# Altium schematic sheet In-Out.SchDoc
size A4
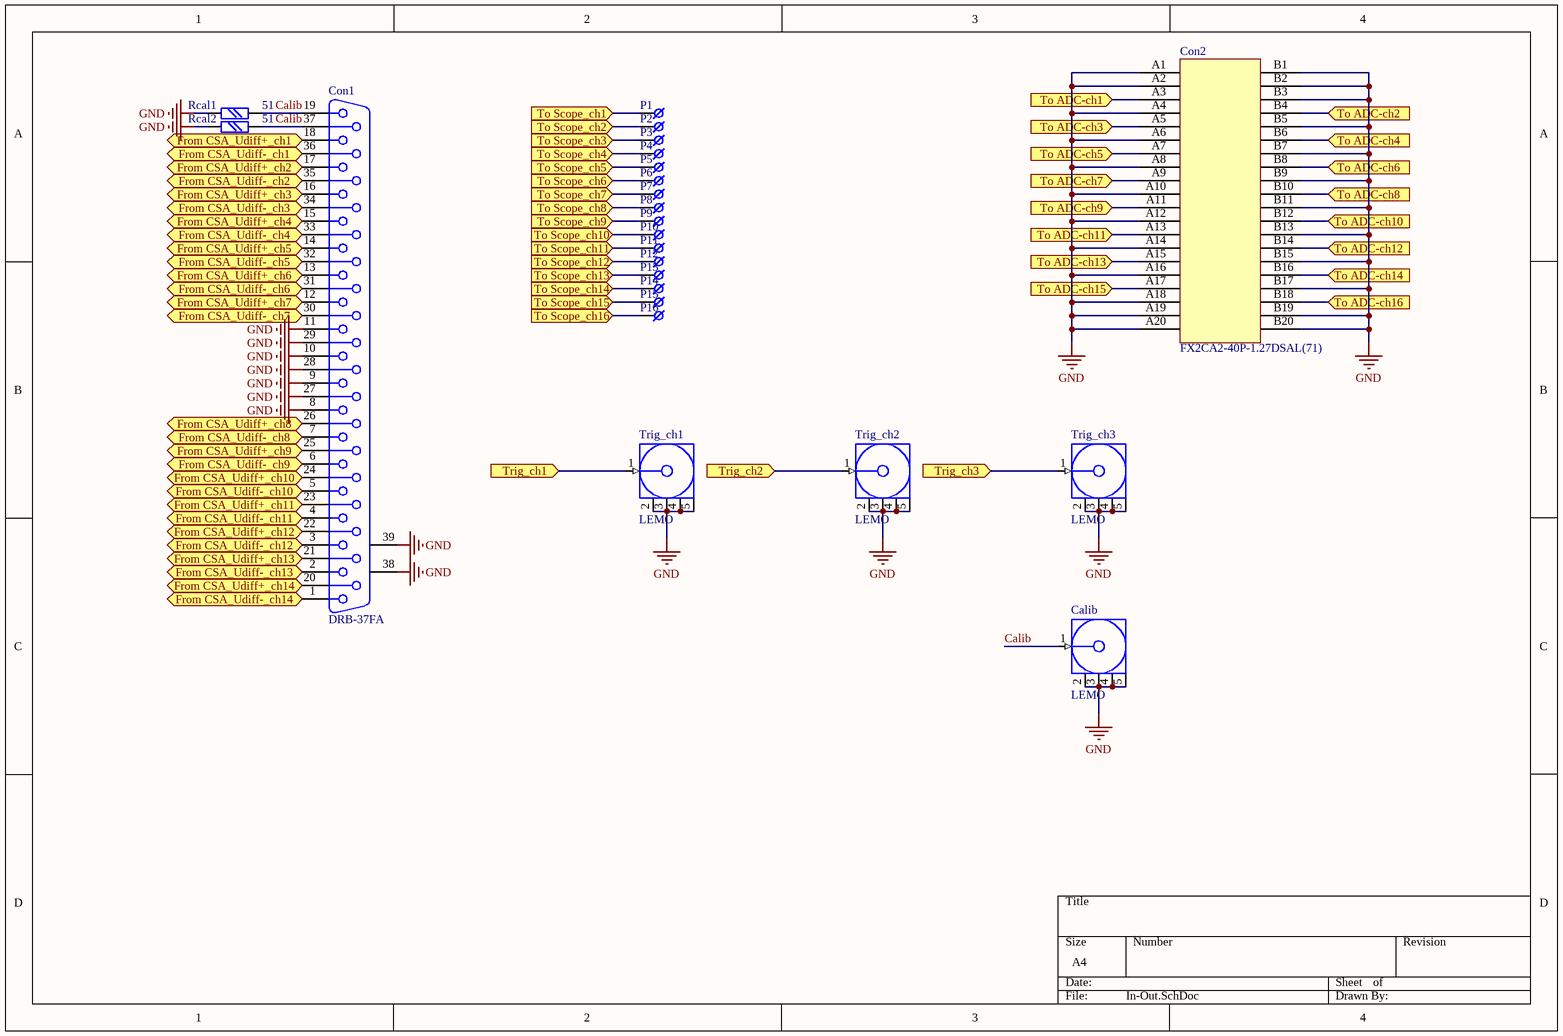
[diagram p0: In-Out.SchDoc]

## Parts
Calib  LEMO  [LEMO]
Con1  DRB-37FA  [DBR-F-37]
Con2  FX2CA2-40P-1.27DSAL(71)
P1  KLEMME  [Pad12]  (value not drawn)
P2  KLEMME  [Pad12]  (value not drawn)
P3  KLEMME  [Pad12]  (value not drawn)
P4  KLEMME  [Pad12]  (value not drawn)
P5  KLEMME  [Pad12]  (value not drawn)
P6  KLEMME  [Pad12]  (value not drawn)
P7  KLEMME  [Pad12]  (value not drawn)
P8  KLEMME  [Pad12]  (value not drawn)
P9  KLEMME  [Pad12]  (value not drawn)
P10  KLEMME  [Pad12]  (value not drawn)
P11  KLEMME  [Pad12]  (value not drawn)
P12  KLEMME  [Pad12]  (value not drawn)
P13  KLEMME  [Pad12]  (value not drawn)
P14  KLEMME  [Pad12]  (value not drawn)
P15  KLEMME  [Pad12]  (value not drawn)
P16  KLEMME  [Pad12]  (value not drawn)
Rcal1  51  [chip0603]
Rcal2  51  [chip0603]
Trig_ch1  LEMO  [LEMO]
Trig_ch2  LEMO  [LEMO]
Trig_ch3  LEMO  [LEMO]

## Ports
From CSA_Udiff+_ch1 (in), From CSA_Udiff+_ch2 (in), From CSA_Udiff+_ch3 (in), From CSA_Udiff+_ch4 (in), From CSA_Udiff+_ch5 (in), From CSA_Udiff+_ch6 (in), From CSA_Udiff+_ch7 (in), From CSA_Udiff+_ch8 (in), From CSA_Udiff+_ch9 (in), From CSA_Udiff+_ch10 (in), From CSA_Udiff+_ch11 (in), From CSA_Udiff+_ch12 (in), From CSA_Udiff+_ch13 (in), From CSA_Udiff+_ch14 (in), From CSA_Udiff-_ch1 (in), From CSA_Udiff-_ch2 (in), From CSA_Udiff-_ch3 (in), From CSA_Udiff-_ch4 (in), From CSA_Udiff-_ch5 (in), From CSA_Udiff-_ch6 (in), From CSA_Udiff-_ch7 (in), From CSA_Udiff-_ch8 (in), From CSA_Udiff-_ch9 (in), From CSA_Udiff-_ch10 (in), From CSA_Udiff-_ch11 (in), From CSA_Udiff-_ch12 (in), From CSA_Udiff-_ch13 (in), From CSA_Udiff-_ch14 (in), To ADC-ch1 (in), To ADC-ch2 (in), To ADC-ch3 (in), To ADC-ch4 (in), To ADC-ch5 (in), To ADC-ch6 (in), To ADC-ch7 (in), To ADC-ch8 (in), To ADC-ch9 (in), To ADC-ch10 (in), To ADC-ch11 (in), To ADC-ch12 (in), To ADC-ch13 (in), To ADC-ch14 (in), To ADC-ch15 (in), To ADC-ch16 (in), To Scope_ch1 (in), To Scope_ch2 (in), To Scope_ch3 (in), To Scope_ch4 (in), To Scope_ch5 (in), To Scope_ch6 (in), To Scope_ch7 (in), To Scope_ch8 (in), To Scope_ch9 (in), To Scope_ch10 (in), To Scope_ch11 (in), To Scope_ch12 (in), To Scope_ch13 (in), To Scope_ch14 (in), To Scope_ch15 (in), To Scope_ch16 (in), Trig_ch1 (in), Trig_ch2 (in), Trig_ch3 (in)

## Nets
GND: Calib.2(GND) Calib.3(GND) Calib.4(GND) Calib.5(GND) Con1.8 Con1.9 Con1.10 Con1.11 Con1.27 Con1.28 Con1.29 Con1.38 Con1.39 Con2.A1 Con2.A2 Con2.A4 Con2.A6 Con2.A8 Con2.A10 Con2.A12 Con2.A14 Con2.A16 Con2.A18 Con2.A19 Con2.A20 Con2.B1 Con2.B2 Con2.B3 Con2.B5 Con2.B7 Con2.B9 Con2.B11 Con2.B13 Con2.B15 Con2.B17 Con2.B19 Con2.B20 Rcal1.2 Rcal2.2 Trig_ch1.2(GND) Trig_ch1.3(GND) Trig_ch1.4(GND) Trig_ch1.5(GND) Trig_ch2.2(GND) Trig_ch2.3(GND) Trig_ch2.4(GND) Trig_ch2.5(GND) Trig_ch3.2(GND) Trig_ch3.3(GND) Trig_ch3.4(GND) Trig_ch3.5(GND)
Calib: Calib.1(Signal) Con1.19 Con1.37 Rcal1.1 Rcal2.1
From CSA_Udiff+_ch1: Con1.18 ; port From CSA_Udiff+_ch1
From CSA_Udiff+_ch2: Con1.17 ; port From CSA_Udiff+_ch2
From CSA_Udiff+_ch3: Con1.16 ; port From CSA_Udiff+_ch3
From CSA_Udiff+_ch4: Con1.15 ; port From CSA_Udiff+_ch4
From CSA_Udiff+_ch5: Con1.14 ; port From CSA_Udiff+_ch5
From CSA_Udiff+_ch6: Con1.13 ; port From CSA_Udiff+_ch6
From CSA_Udiff+_ch7: Con1.12 ; port From CSA_Udiff+_ch7
From CSA_Udiff+_ch8: Con1.26 ; port From CSA_Udiff+_ch8
From CSA_Udiff+_ch9: Con1.25 ; port From CSA_Udiff+_ch9
From CSA_Udiff+_ch10: Con1.24 ; port From CSA_Udiff+_ch10
From CSA_Udiff+_ch11: Con1.23 ; port From CSA_Udiff+_ch11
From CSA_Udiff+_ch12: Con1.22 ; port From CSA_Udiff+_ch12
From CSA_Udiff+_ch13: Con1.21 ; port From CSA_Udiff+_ch13
From CSA_Udiff+_ch14: Con1.20 ; port From CSA_Udiff+_ch14
From CSA_Udiff-_ch1: Con1.36 ; port From CSA_Udiff-_ch1
From CSA_Udiff-_ch2: Con1.35 ; port From CSA_Udiff-_ch2
From CSA_Udiff-_ch3: Con1.34 ; port From CSA_Udiff-_ch3
From CSA_Udiff-_ch4: Con1.33 ; port From CSA_Udiff-_ch4
From CSA_Udiff-_ch5: Con1.32 ; port From CSA_Udiff-_ch5
From CSA_Udiff-_ch6: Con1.31 ; port From CSA_Udiff-_ch6
From CSA_Udiff-_ch7: Con1.30 ; port From CSA_Udiff-_ch7
From CSA_Udiff-_ch8: Con1.7 ; port From CSA_Udiff-_ch8
From CSA_Udiff-_ch9: Con1.6 ; port From CSA_Udiff-_ch9
From CSA_Udiff-_ch10: Con1.5 ; port From CSA_Udiff-_ch10
From CSA_Udiff-_ch11: Con1.4 ; port From CSA_Udiff-_ch11
From CSA_Udiff-_ch12: Con1.3 ; port From CSA_Udiff-_ch12
From CSA_Udiff-_ch13: Con1.2 ; port From CSA_Udiff-_ch13
From CSA_Udiff-_ch14: Con1.1 ; port From CSA_Udiff-_ch14
To ADC-ch1: Con2.A3 ; port To ADC-ch1
To ADC-ch2: Con2.B4 ; port To ADC-ch2
To ADC-ch3: Con2.A5 ; port To ADC-ch3
To ADC-ch4: Con2.B6 ; port To ADC-ch4
To ADC-ch5: Con2.A7 ; port To ADC-ch5
To ADC-ch6: Con2.B8 ; port To ADC-ch6
To ADC-ch7: Con2.A9 ; port To ADC-ch7
To ADC-ch8: Con2.B10 ; port To ADC-ch8
To ADC-ch9: Con2.A11 ; port To ADC-ch9
To ADC-ch10: Con2.B12 ; port To ADC-ch10
To ADC-ch11: Con2.A13 ; port To ADC-ch11
To ADC-ch12: Con2.B14 ; port To ADC-ch12
To ADC-ch13: Con2.A15 ; port To ADC-ch13
To ADC-ch14: Con2.B16 ; port To ADC-ch14
To ADC-ch15: Con2.A17 ; port To ADC-ch15
To ADC-ch16: Con2.B18 ; port To ADC-ch16
To Scope_ch1: P1.PAD ; port To Scope_ch1
To Scope_ch2: P2.PAD ; port To Scope_ch2
To Scope_ch3: P3.PAD ; port To Scope_ch3
To Scope_ch4: P4.PAD ; port To Scope_ch4
To Scope_ch5: P5.PAD ; port To Scope_ch5
To Scope_ch6: P6.PAD ; port To Scope_ch6
To Scope_ch7: P7.PAD ; port To Scope_ch7
To Scope_ch8: P8.PAD ; port To Scope_ch8
To Scope_ch9: P9.PAD ; port To Scope_ch9
To Scope_ch10: P10.PAD ; port To Scope_ch10
To Scope_ch11: P11.PAD ; port To Scope_ch11
To Scope_ch12: P12.PAD ; port To Scope_ch12
To Scope_ch13: P13.PAD ; port To Scope_ch13
To Scope_ch14: P14.PAD ; port To Scope_ch14
To Scope_ch15: P15.PAD ; port To Scope_ch15
To Scope_ch16: P16.PAD ; port To Scope_ch16
Trig_ch1: Trig_ch1.1(Signal) ; port Trig_ch1
Trig_ch2: Trig_ch2.1(Signal) ; port Trig_ch2
Trig_ch3: Trig_ch3.1(Signal) ; port Trig_ch3

## Library data of the parts
Calib Trig_ch1-Trig_ch3 = COAX-F: RF Coaxial PCB Connector, MCX; Thru-Hole, Right-Angle Mount Socket, Blunt Post Terminal, 50 Ohm Impedance; PCB_Layout: Complies with manufacturer's recommendation.; DrillSize: Corresponds to nominal value.; Published: 15-Jul-2004; LatestRevisionDate: 15-Jul-2004; LatestRevisionNote: Component Replaced.; DatasheetDocument: 30-May-2003; PackageDocument: 04-Jul-1999; PackageReference: 919-119J-51AX; Publisher: Altium Limited; ComponentLink1Description: Manufacturer Link; ComponentLink1URL: http://www.amphenolrf.com/
Con1 = DBR-37F
P1-P16 = KLEMME: Text Field1: 10; Text Field2: 20
Rcal1 Rcal2 = R: Text Field1: 20; Text Field2: 20